# Altium schematic sheet Motor_driver.SchDoc: Smartknob Motor Driver
size A3; DrawnBy: Mani Magnusson; Revision: 1; SheetNumber: 3; SheetTotal: 5
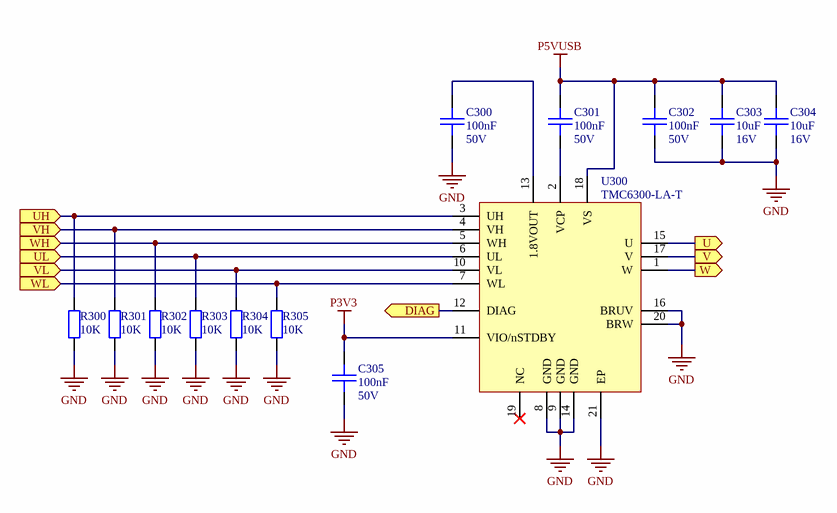
[diagram p0: Motor_driver.SchDoc]

## Parts
C300  value 100nF  Voltage: 50V  [C0402]  (hidden comment: CAP)
C301  value 100nF  Voltage: 50V  [C0402]  (hidden comment: CAP)
C302  value 100nF  Voltage: 50V  [C0402]  (hidden comment: CAP)
C303  value 10uF  Voltage: 16V  [C0805]  (hidden comment: CAP)
C304  value 10uF  Voltage: 16V  [C0805]  (hidden comment: CAP)
C305  value 100nF  Voltage: 50V  [C0402]  (hidden comment: CAP)
R300  value 10K  [R0402]  (hidden comment: RES)
R301  value 10K  [R0402]  (hidden comment: RES)
R302  value 10K  [R0402]  (hidden comment: RES)
R303  value 10K  [R0402]  (hidden comment: RES)
R304  value 10K  [R0402]  (hidden comment: RES)
R305  value 10K  [R0402]  (hidden comment: RES)
U300  Manufacturer Part No: TMC6300-LA-T  [TMC6300]  (hidden comment: TMC6300)

## Ports
DIAG (out), U (out), UH (in), UL (in), V (out), VH (in), VL (in), W (out), WH (in), WL (in)

## Nets
GND: C300.2 C302.2 C303.2 C304.2 C305.2 R300.1 R301.1 R302.1 R303.1 R304.1 R305.1 U300.8(GND) U300.9(GND) U300.14(GND) U300.16(BRUV) U300.20(BRW) U300.21(EP)
P3V3: C305.1 U300.11(VIO/nSTDBY)
P5VUSB: C301.1 C302.1 C303.1 C304.1 U300.18(VS)
DIAG: U300.12(DIAG) ; port DIAG
U: U300.15(U) ; port U
UH: R300.2 U300.3(UH) ; port UH
UL: R303.2 U300.6(UL) ; port UL
V: U300.17(V) ; port V
VH: R301.2 U300.4(VH) ; port VH
VL: R304.2 U300.10(VL) ; port VL
W: U300.1(W) ; port W
WH: R302.2 U300.5(WH) ; port WH
WL: R305.2 U300.7(WL) ; port WL
NetC300_1: C300.1 U300.13(1.8VOUT)
NetC301_2: C301.2 U300.2(VCP)

Not connected (* = marked no-connect by the designer): U300 19(NC)*

## Notes on the sheet
- Sheet title:
- Revision:
- Drawn by:
- Date:
- File:

## Library data of the parts
C300-C302 C305 = GRT155R71H104KE01D: General purpose ceramic capacitor; Manufacturer: Murata Electronics; Specification: X7R, 50V, AEC-Q200 Qualified; Ready for use: y; Fitted: Fitted; Package Ref: C0402; Part Reference: GRT155R71H104KE01D; Manufacturer Part No: GRT155R71H104KE01D; Supplier: Digi-Key; Supplier Part No: 490-GRT155R71H104KE01DCT-ND; Generic: Generic
C303 C304 = CGA4J1X7S1C106K125AC: General purpose ceramic capacitor; Manufacturer: TDK Corporation; Specification: X7S, 16V, AEC-Q200 Qualified; Ready for use: y; Fitted: Fitted; Package Ref: C0805; Part Reference: CGA4J1X7S1C106K125AC; Manufacturer Part No: CGA4J1X7S1C106K125AC; Supplier: Digi-Key; Supplier Part No: 445-16110-1-ND; Generic: Generic
R300-R305 = Generic 0402 resistor: General purpose resistor; Manufacturer Part No: Generic resistor; Ready for use: y; Fitted: Fitted; Package Ref: R0402; Part Reference: Generic 0402 resistor; Manufacturer: N/A; Supplier: N/A; Supplier Part No: N/A; Generic: Generic
U300 = TMC6300-LA-T: 2-11V 2A 3-phase BLDC motor driver; Manufacturer: Trinamic Motion Control GmbH; Package Ref: QFN-20 (3x3); Generic: Non Generic; Ready for use: y; Fitted: Fitted; Part Reference: TMC6300-LA-T; Supplier: Digi-Key; Supplier Part No: 1460-TMC6300-LA-TCT-ND; Type: Motor Driver